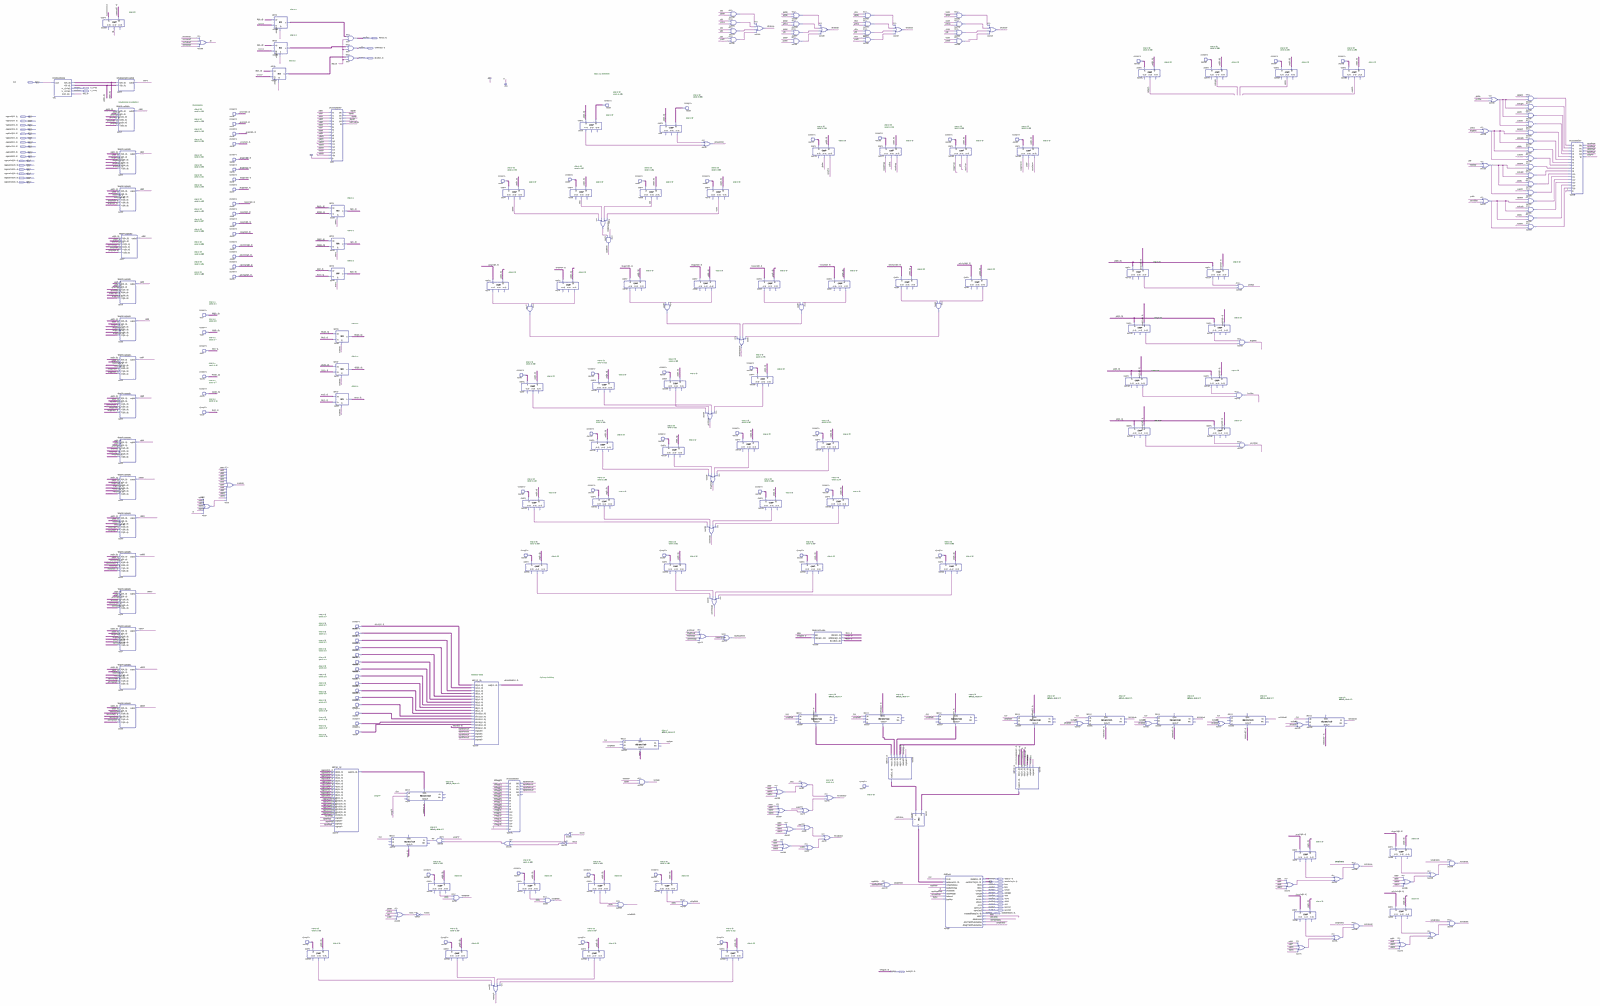
[diagram p0: schematic sheet, whole]
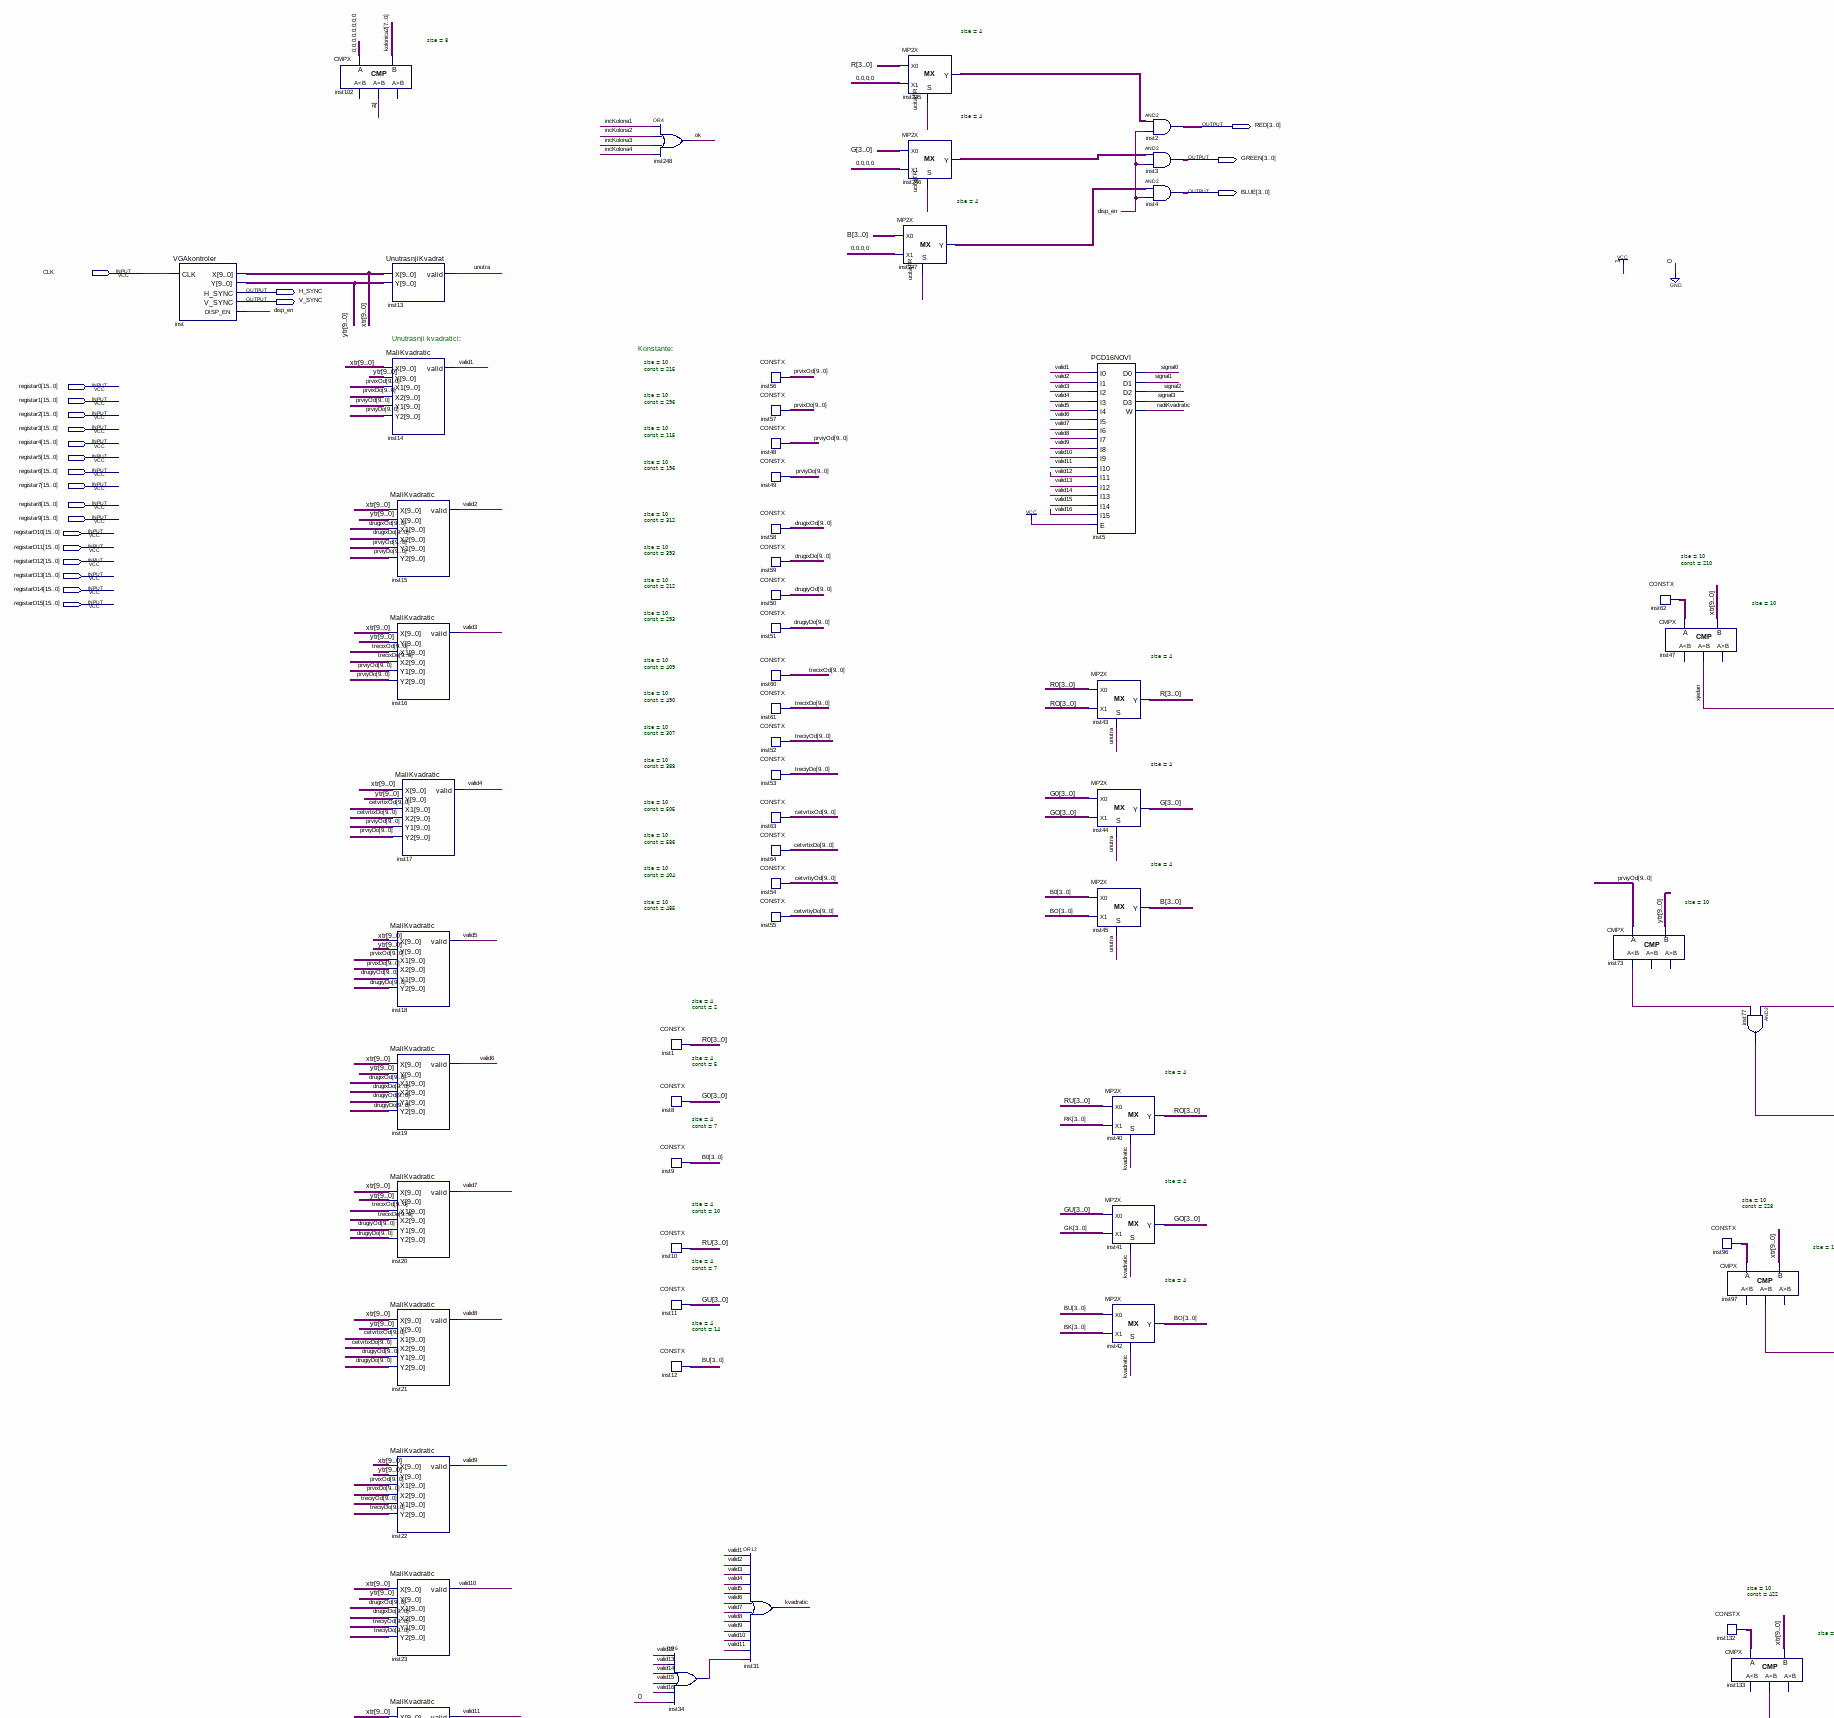
[diagram p1: schematic sheet, upper left part]
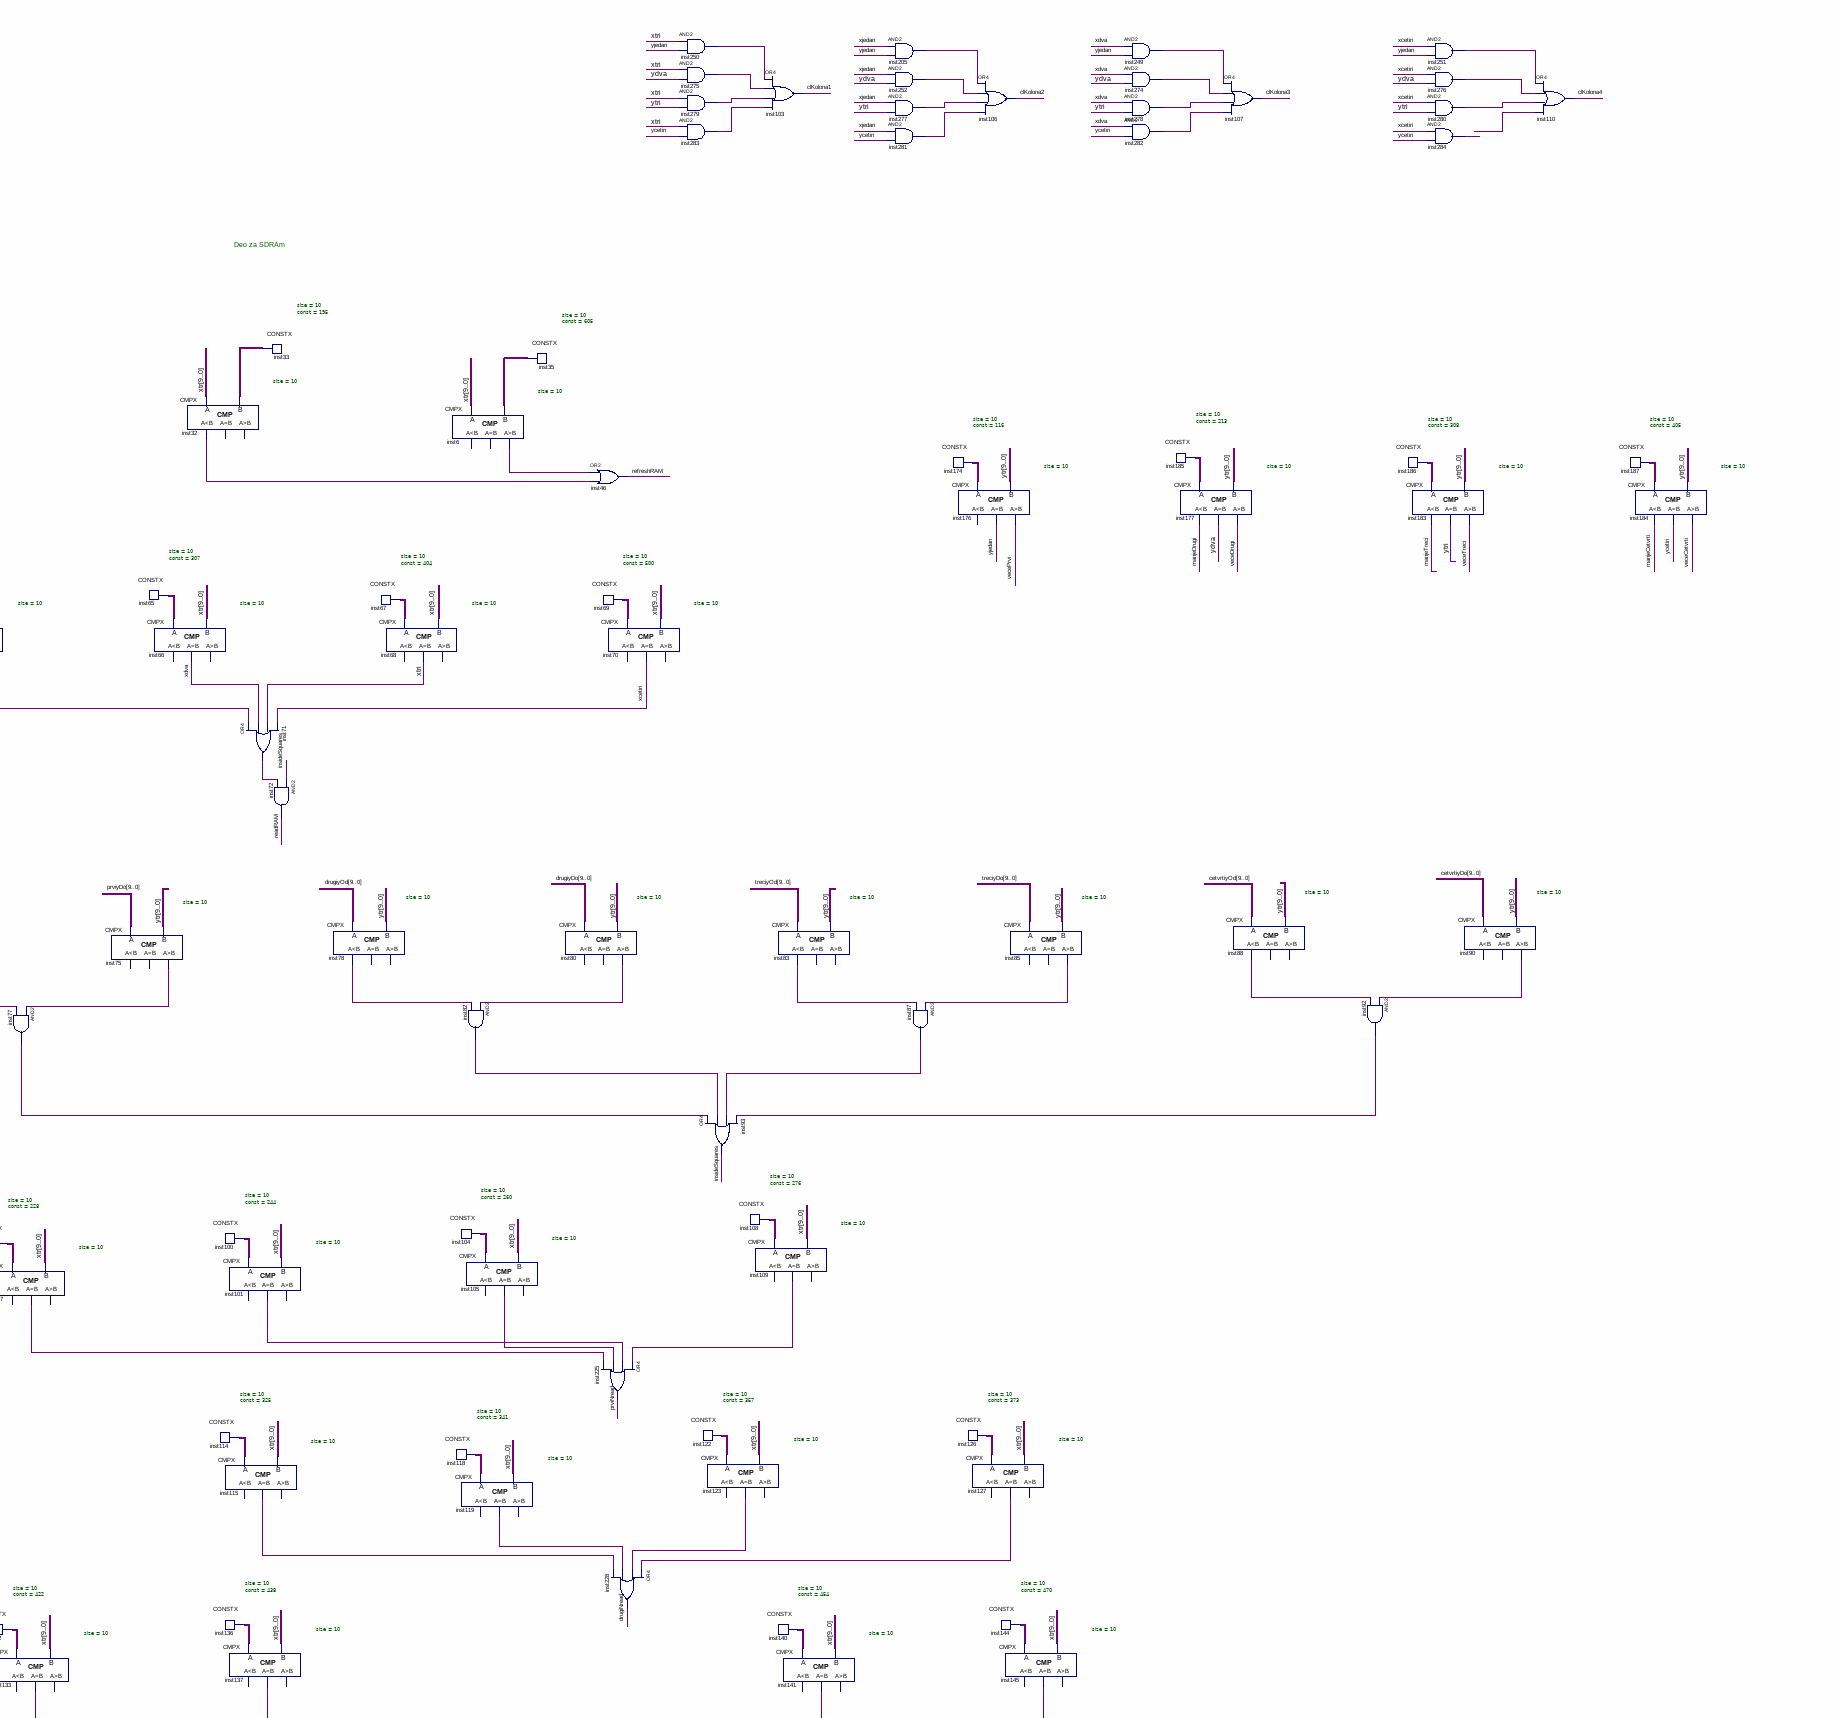
[diagram p2: schematic sheet, upper centre part]
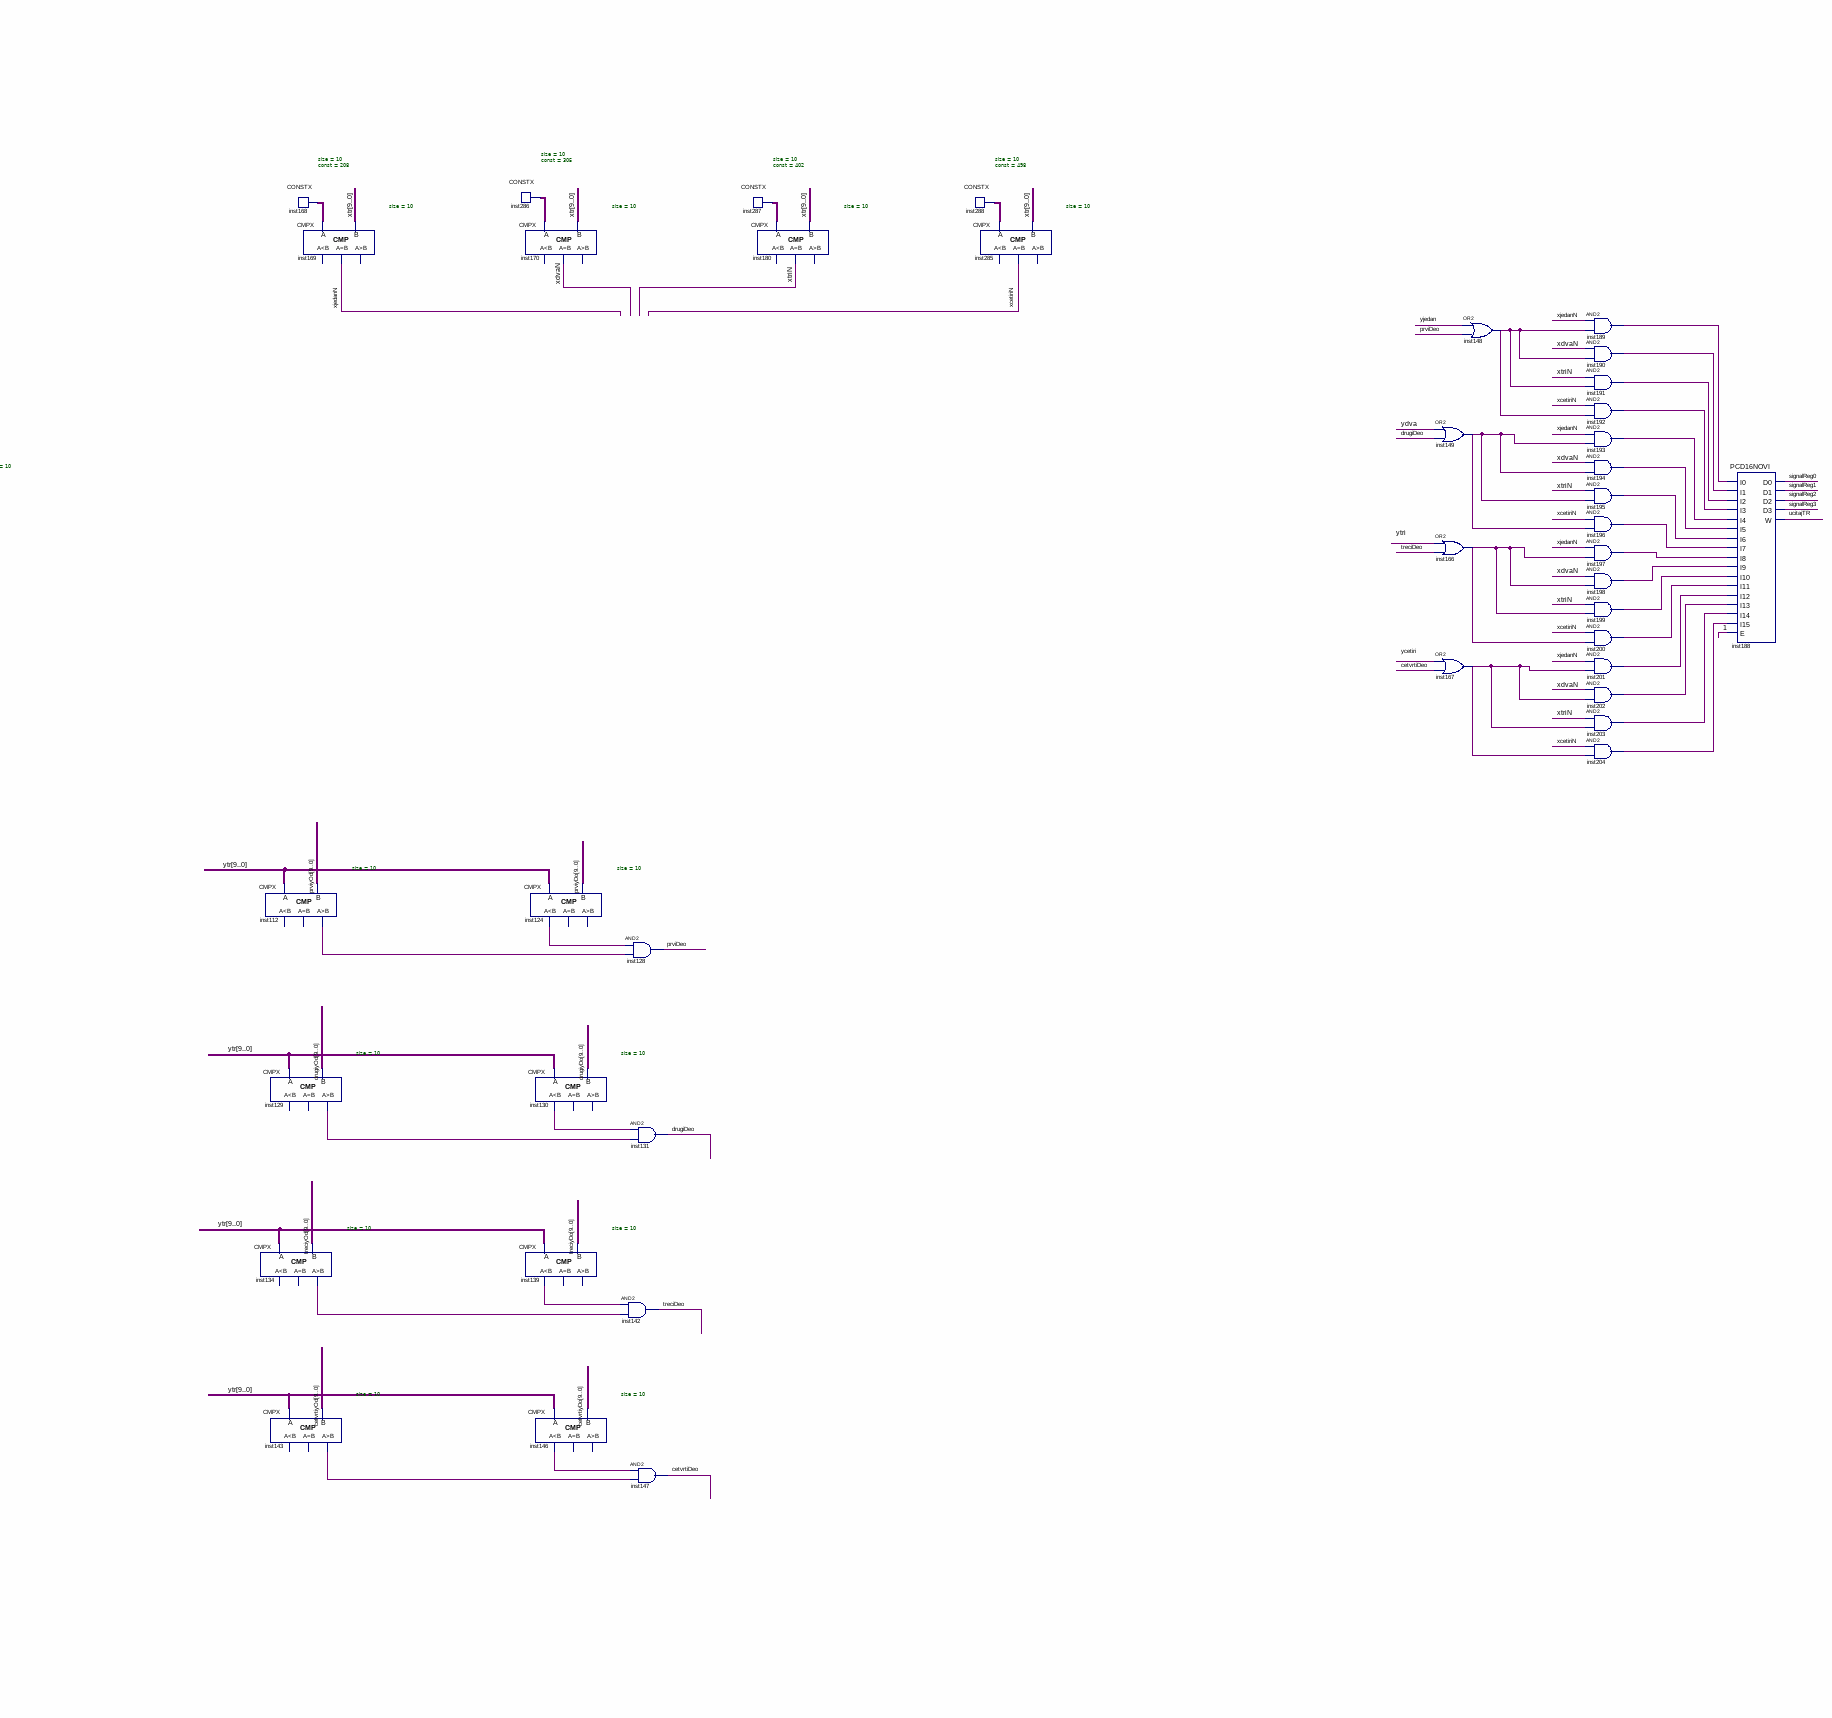
[diagram p3: schematic sheet, upper right part]
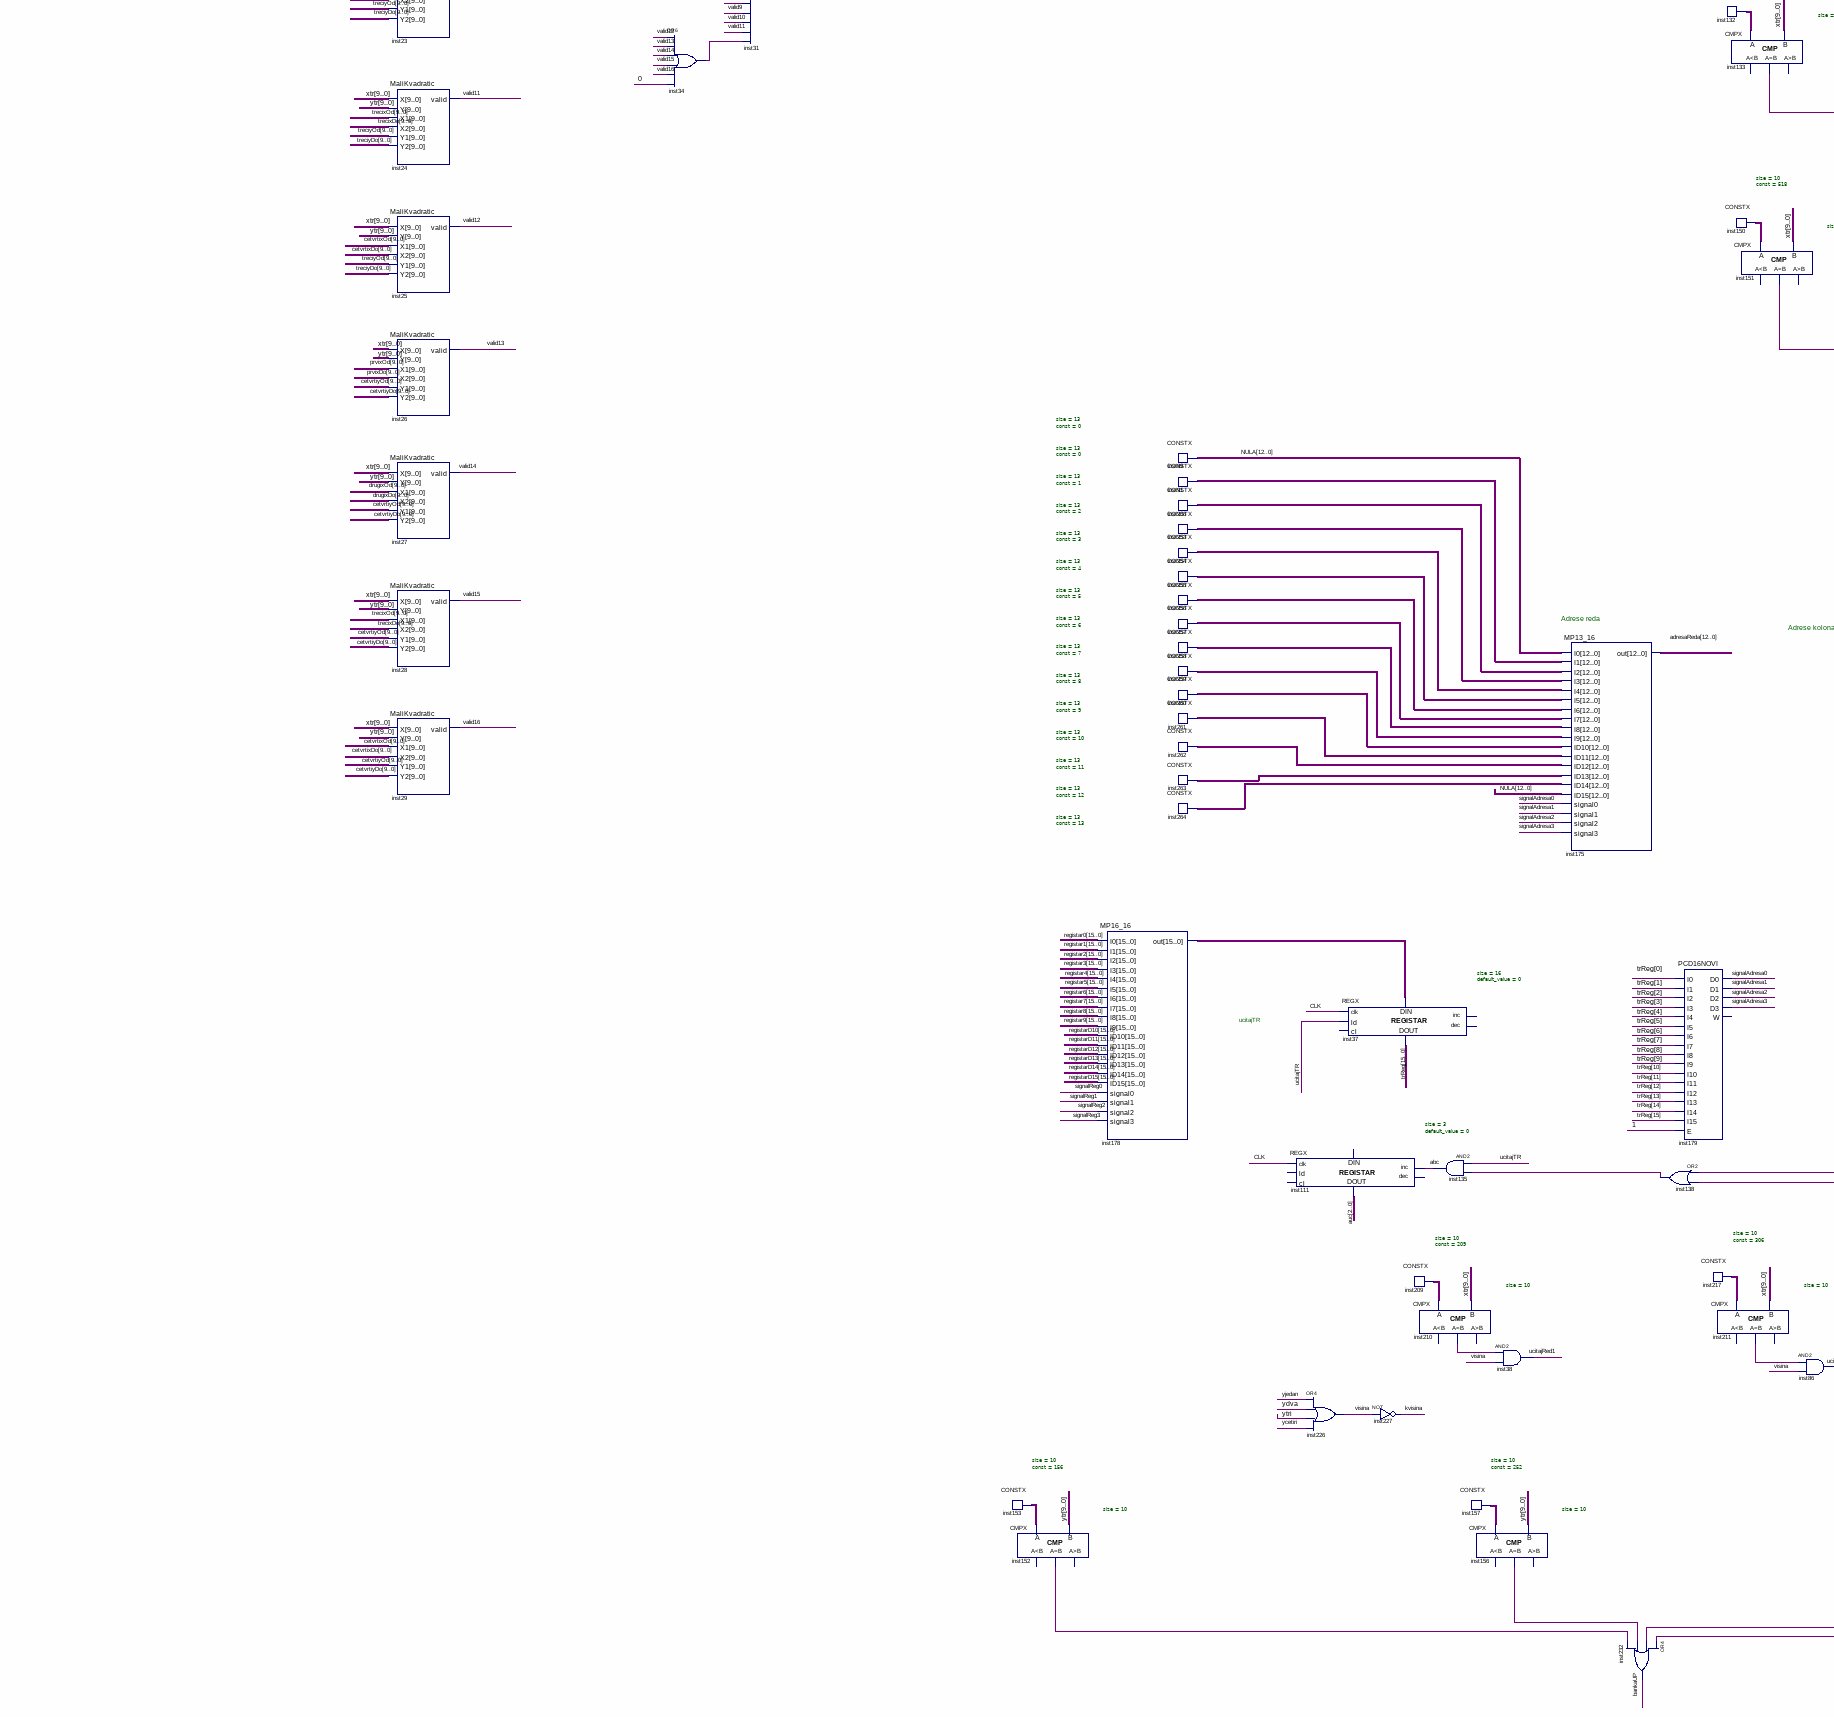
[diagram p4: schematic sheet, lower left part]
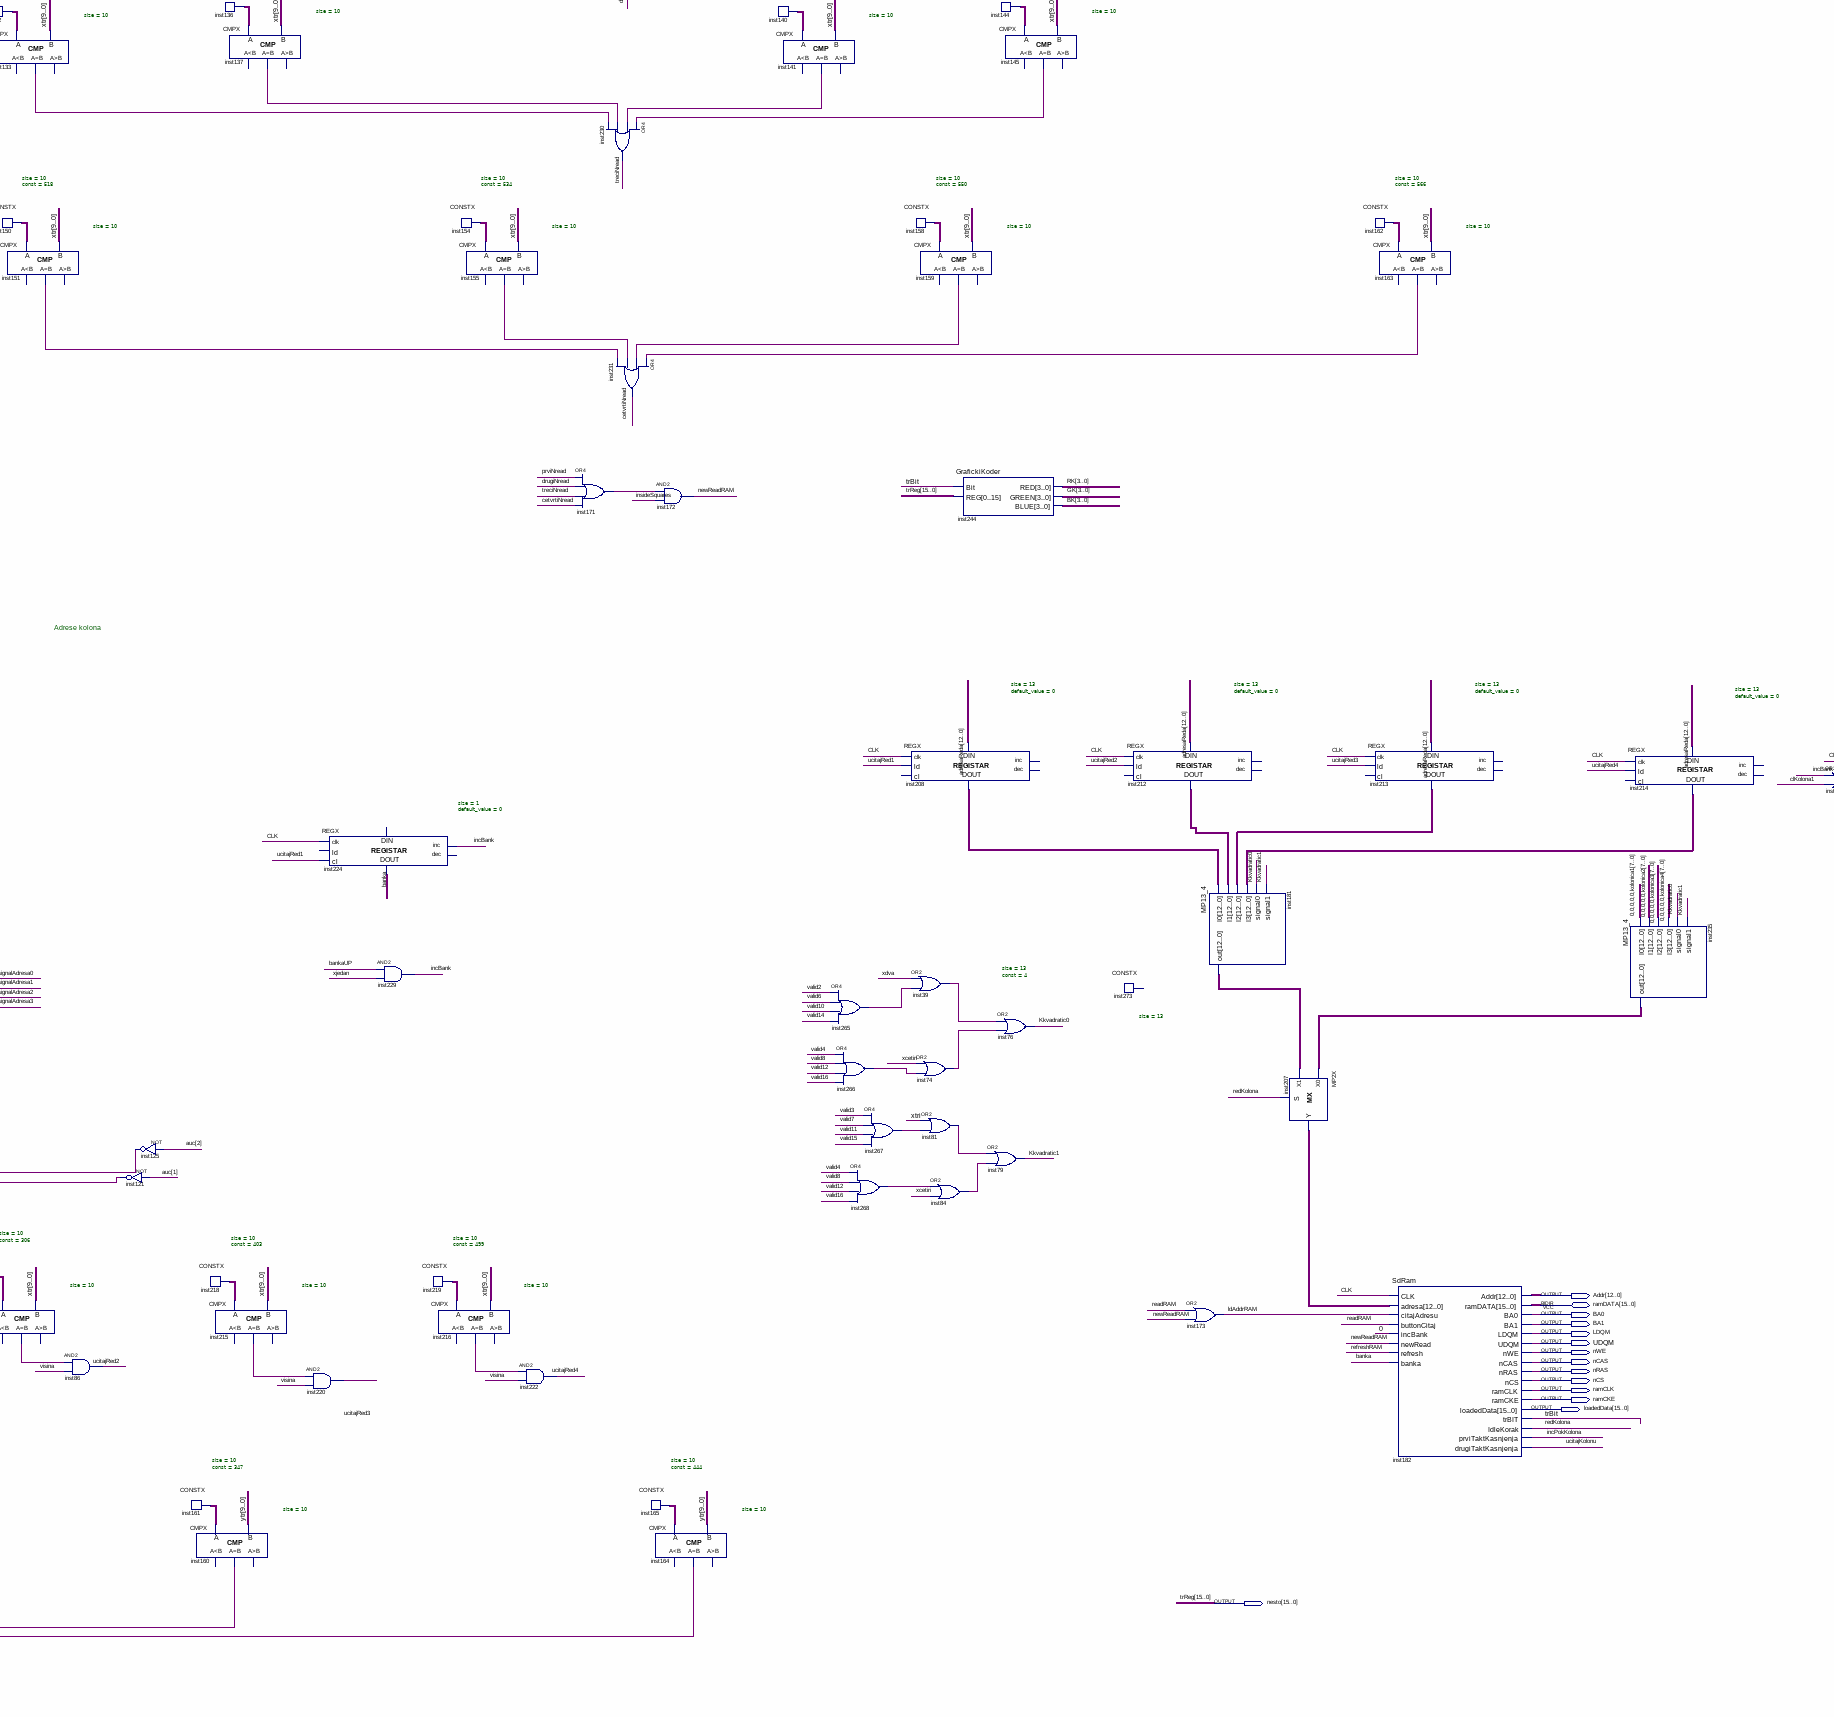
[diagram p5: schematic sheet, lower centre part]
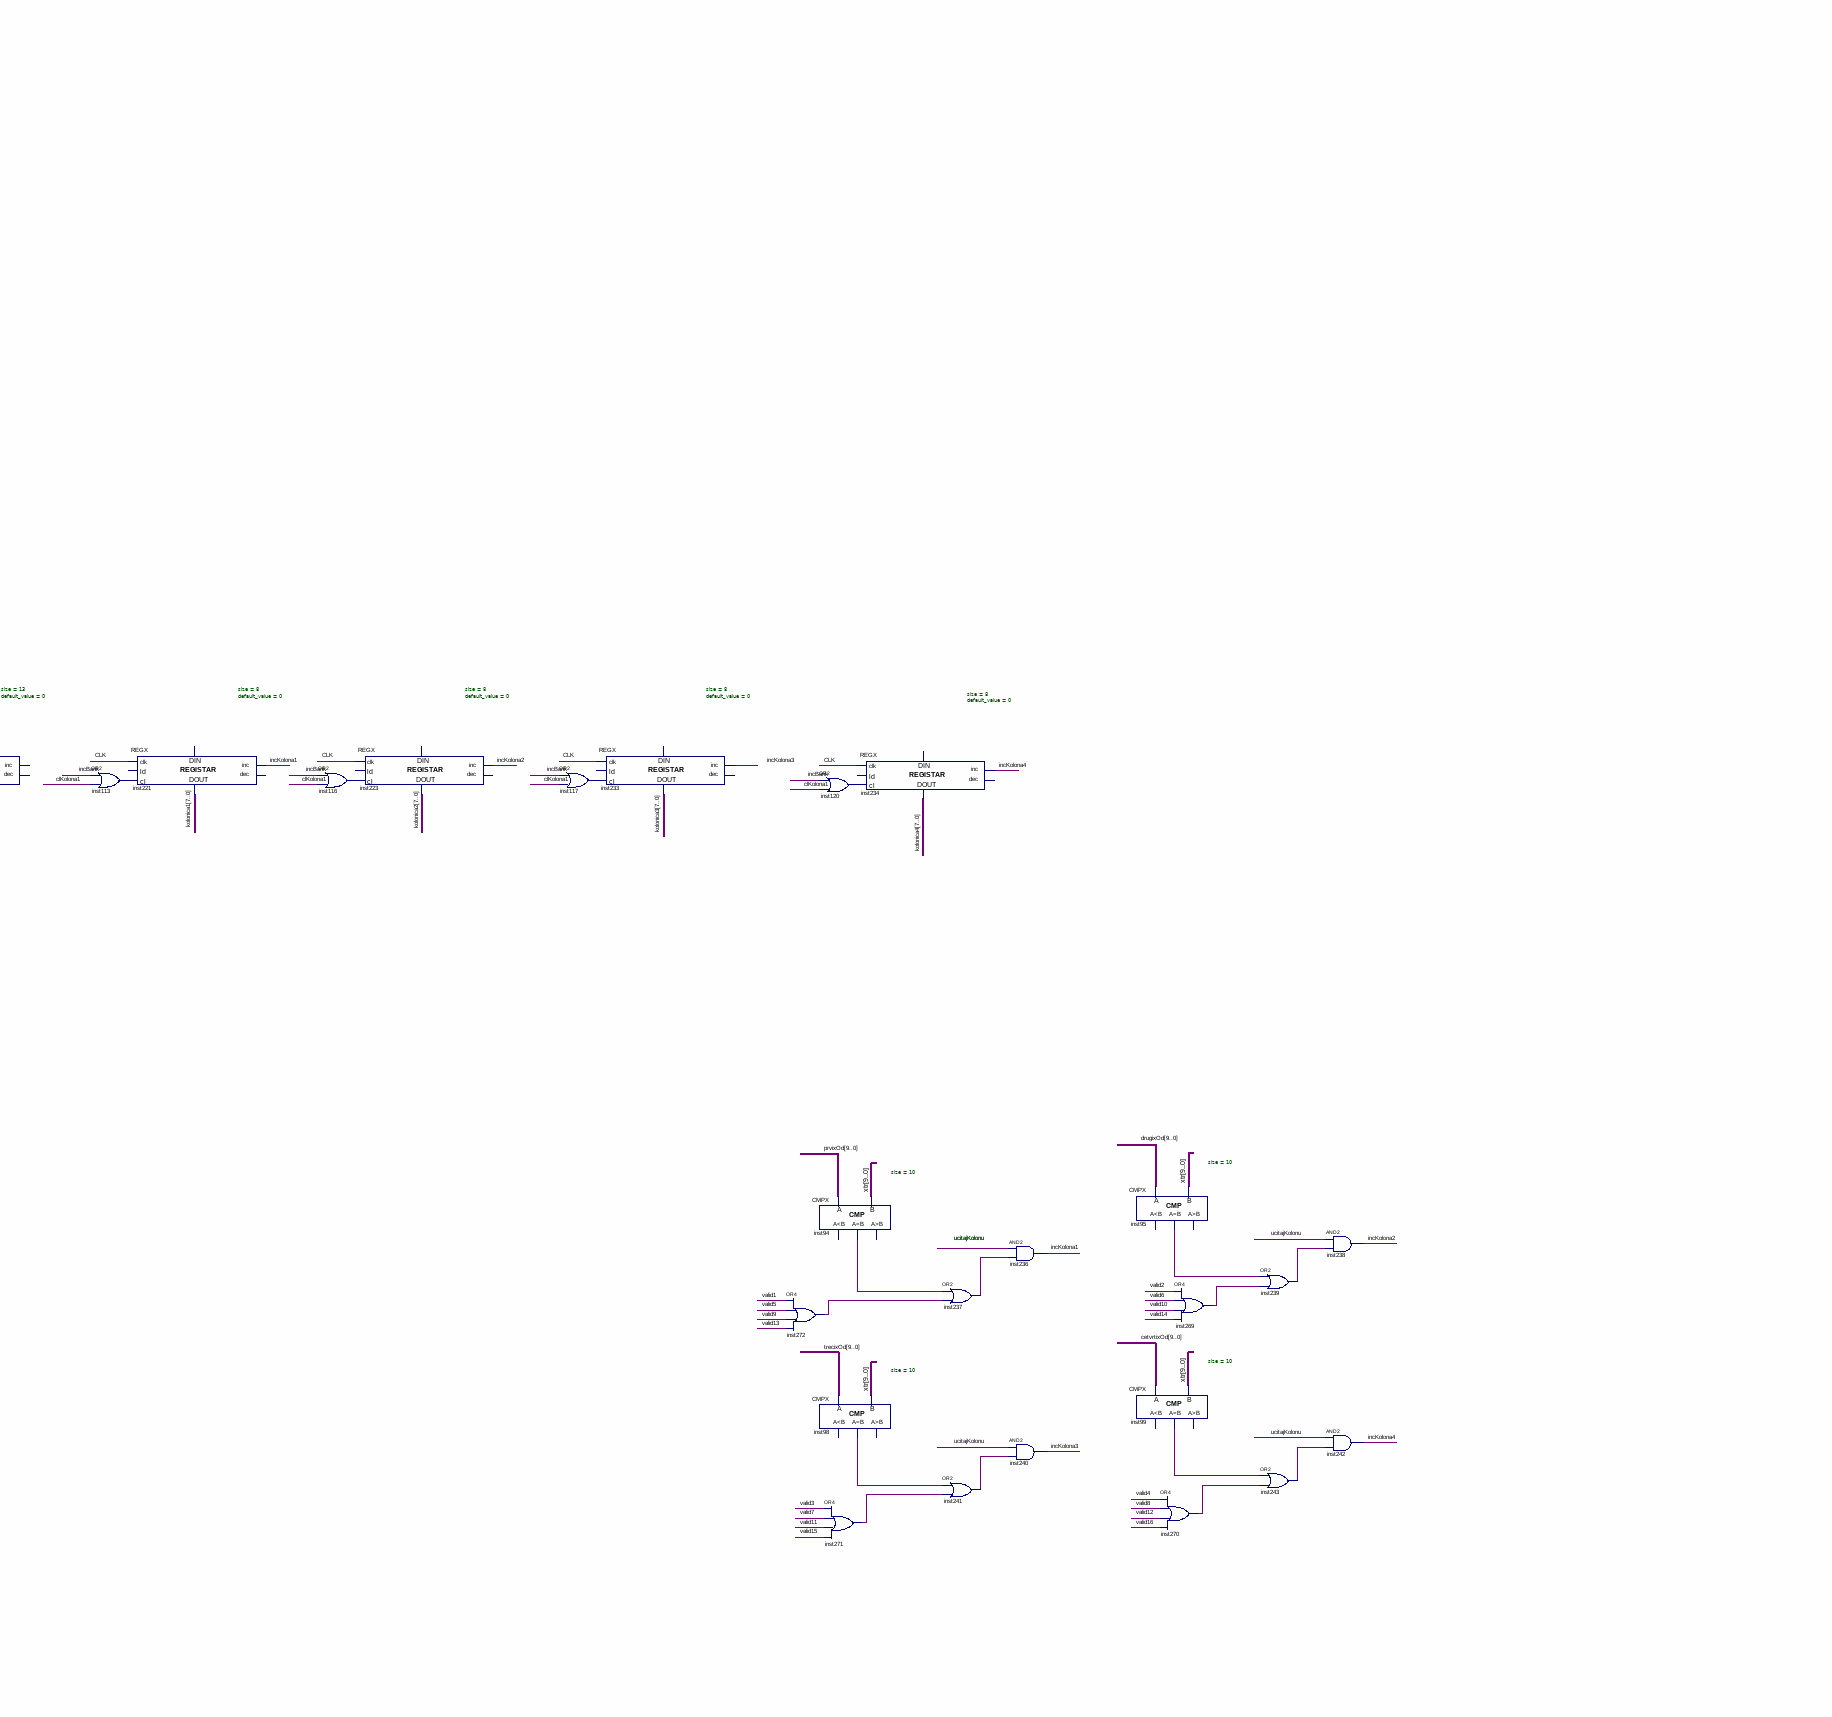
[diagram p6: schematic sheet, lower right part]
// Quartus schematic Grafika.bdf as structural Verilog: 286 symbols, 36 pins
module Grafika (
  input  CLK,
  input  [15:0] registar0,
  input  [15:0] registar1,
  input  [15:0] registar2,
  input  [15:0] registar3,
  input  [15:0] registar4,
  input  [15:0] registar5,
  input  [15:0] registar6,
  input  [15:0] registar7,
  input  [15:0] registar8,
  input  [15:0] registar9,
  input  [15:0] registarD10,
  input  [15:0] registarD11,
  input  [15:0] registarD12,
  input  [15:0] registarD13,
  input  [15:0] registarD14,
  input  [15:0] registarD15,
  inout  [15:0] ramDATA,
  output [3:0] RED,
  output [3:0] GREEN,
  output [3:0] BLUE,
  output H_SYNC,
  output V_SYNC,
  output [12:0] Addr,
  output BA0,
  output BA1,
  output LDQM,
  output UDQM,
  output nWE,
  output nCAS,
  output nRAS,
  output nCS,
  output ramCLK,
  output ramCKE,
  output [15:0] loadedData,
  output [15:0] nesto
);

  wire abc, aj, banka, bankaUP, cetvrtiDeo, cetvrtiNread, clKolona1, clKolona2, clKolona3, clKolona4,
       disp_en, drugiDeo, drugiNread, incBank, incKolona1, incKolona2, incKolona3, incKolona4, incPokKolona,
       insideSquares, inst6_gr, inst32_ls, inst34_out, inst39_out, inst71_out, inst73_ls, inst74_out,
       inst75_gr, inst77_out, inst78_ls, inst80_gr, inst81_out, inst82_out, inst83_ls, inst84_out, inst85_gr,
       inst87_out, inst88_ls, inst90_gr, inst92_out, inst94_eq, inst95_eq, inst97_eq, inst98_eq, inst99_eq,
       inst101_eq, inst105_eq, inst109_eq, inst112_gr, inst113_out, inst115_eq, inst116_out, inst117_out,
       inst119_eq, inst120_out, inst121_out, inst123_eq, inst124_ls, inst125_out, inst127_eq, inst129_gr,
       inst130_ls, inst133_eq, inst134_gr, inst137_eq, inst138_out, inst139_ls, inst141_eq, inst143_gr,
       inst145_eq, inst146_ls, inst148_out, inst149_out, inst151_eq, inst152_eq, inst155_eq, inst156_eq,
       inst159_eq, inst160_eq, inst163_eq, inst164_eq, inst166_out, inst167_out, inst171_out, inst189_out,
       inst190_out, inst191_out, inst192_out, inst193_out, inst194_out, inst195_out, inst196_out,
       inst197_out, inst198_out, inst199_out, inst200_out, inst201_out, inst202_out, inst203_out,
       inst204_out, inst205_out, inst210_eq, inst211_eq, inst215_eq, inst216_eq, inst237_out, inst239_out,
       inst241_out, inst243_out, inst249_out, inst250_out, inst251_out, inst252_out, inst265_out,
       inst266_out, inst267_out, inst268_out, inst269_out, inst270_out, inst271_out, inst272_out,
       inst274_out, inst275_out, inst276_out, inst277_out, inst278_out, inst279_out, inst280_out,
       inst281_out, inst282_out, inst283_out, inst284_out, Kkvadratic0, Kkvadratic1, kvadratic, kvisina,
       ldAddrRAM, manjeCetvrti, manjeDrugi, manjeTreci, newReadRAM, ok, prviDeo, prviNread, radiKvadratic,
       readRAM, redKolona, refreshRAM, signal0, signal1, signal2, signal3, signalAdresa0, signalAdresa1,
       signalAdresa2, signalAdresa3, signalReg0, signalReg1, signalReg2, signalReg3, trBit, treciDeo,
       treciNread, ucitajKolonu, ucitajRed1, ucitajRed2, ucitajRed3, ucitajRed4, ucitajTR, undriven, unutra,
       valid1, valid2, valid3, valid4, valid5, valid6, valid7, valid8, valid9, valid10, valid11, valid12,
       valid13, valid14, valid15, valid16, veceCetvrti, veceDrugi, vecePrvi, veceTreci, visina, xcetiri,
       xcetiriN, xdva, xdvaN, xjedan, xjedanN, xtri, xtriN, ycetiri, ydva, yjedan, ytri;
  wire [2:0] auc;
  wire [3:0] B, B0, BK, BO, BU, G, G0, GK, GO, GU, inst245_y, inst246_y, inst247_y, R, R0, RK, RO, RU;
  wire [7:0] kolonica1, kolonica2, kolonica3, kolonica4;
  wire [9:0] cetvrtixDo, cetvrtixOd, cetvrtiyDo, cetvrtiyOd, drugixDo, drugixOd, drugiyDo, drugiyOd,
       inst33_data, inst35_data, inst62_data, inst65_data, inst67_data, inst69_data, inst96_data,
       inst100_data, inst104_data, inst108_data, inst114_data, inst118_data, inst122_data, inst126_data,
       inst132_data, inst136_data, inst140_data, inst144_data, inst150_data, inst153_data, inst154_data,
       inst157_data, inst158_data, inst161_data, inst162_data, inst165_data, inst168_data, inst174_data,
       inst185_data, inst186_data, inst187_data, inst209_data, inst217_data, inst218_data, inst219_data,
       inst286_data, inst287_data, inst288_data, prvixDo, prvixOd, prviyDo, prviyOd, trecixDo, trecixOd,
       treciyDo, treciyOd, xtr, ytr;
  wire [12:0] adresaReda, inst91_data, inst181_out, inst206_data, inst207_y, inst208_data_out,
       inst212_data_out, inst213_data_out, inst214_data_out, inst235_out, inst253_data, inst254_data,
       inst255_data, inst256_data, inst257_data, inst258_data, inst259_data, inst260_data, inst261_data,
       inst262_data, inst263_data, inst264_data, NULA;
  wire [15:0] inst178_out;

  VGAkontroler inst (.CLK(CLK), .X(xtr), .Y(ytr), .H_SYNC(H_SYNC), .V_SYNC(V_SYNC), .DISP_EN(disp_en));
  CMPX #(.size(8)) inst102 (.A({8{1'b0}}), .B(kolonica2), .eq(aj));  // open: ls, gr
  UnutrasnjiKvadrat inst13 (.X(xtr), .Y(ytr), .valid(unutra));
  MaliKvadratic inst14 (.X(xtr), .Y(ytr), .X1(prvixOd), .X2(prvixDo), .Y1(prviyOd), .Y2(prviyDo), .valid(valid1));
  MaliKvadratic inst15 (.X(xtr), .Y(ytr), .X1(drugixOd), .X2(drugixDo), .Y1(prviyOd), .Y2(prviyDo), .valid(valid2));
  MaliKvadratic inst16 (.X(xtr), .Y(ytr), .X1(trecixOd), .X2(trecixDo), .Y1(prviyOd), .Y2(prviyDo), .valid(valid3));
  MaliKvadratic inst17 (.X(xtr), .Y(ytr), .X1(cetvrtixOd), .X2(cetvrtixDo), .Y1(prviyOd), .Y2(prviyDo), .valid(valid4));
  MaliKvadratic inst18 (.X(xtr), .Y(ytr), .X1(prvixOd), .X2(prvixDo), .Y1(drugiyOd), .Y2(drugiyDo), .valid(valid5));
  MaliKvadratic inst19 (.X(xtr), .Y(ytr), .X1(drugixOd), .X2(drugixDo), .Y1(drugiyOd), .Y2(drugiyDo), .valid(valid6));
  MaliKvadratic inst20 (.X(xtr), .Y(ytr), .X1(trecixOd), .X2(trecixDo), .Y1(drugiyOd), .Y2(drugiyDo), .valid(valid7));
  MaliKvadratic inst21 (
    .X(xtr), .Y(ytr), .X1(cetvrtixOd), .X2(cetvrtixDo), .Y1(drugiyOd), .Y2(drugiyDo), .valid(valid8));
  MaliKvadratic inst22 (.X(xtr), .Y(ytr), .X1(prvixOd), .X2(prvixDo), .Y1(treciyOd), .Y2(treciyDo), .valid(valid9));
  MaliKvadratic inst23 (.X(xtr), .Y(ytr), .X1(drugixOd), .X2(drugixDo), .Y1(treciyOd), .Y2(treciyDo), .valid(valid10));
  MaliKvadratic inst24 (.X(xtr), .Y(ytr), .X1(trecixOd), .X2(trecixDo), .Y1(treciyOd), .Y2(treciyDo), .valid(valid11));
  MaliKvadratic inst25 (
    .X(xtr), .Y(ytr), .X1(cetvrtixOd), .X2(cetvrtixDo), .Y1(treciyOd), .Y2(treciyDo), .valid(valid12));
  MaliKvadratic inst26 (
    .X(xtr), .Y(ytr), .X1(prvixOd), .X2(prvixDo), .Y1(cetvrtiyOd), .Y2(cetvrtiyDo), .valid(valid13));
  MaliKvadratic inst27 (
    .X(xtr), .Y(ytr), .X1(drugixOd), .X2(drugixDo), .Y1(cetvrtiyOd), .Y2(cetvrtiyDo), .valid(valid14));
  MaliKvadratic inst28 (
    .X(xtr), .Y(ytr), .X1(trecixOd), .X2(trecixDo), .Y1(cetvrtiyOd), .Y2(cetvrtiyDo), .valid(valid15));
  MaliKvadratic inst29 (
    .X(xtr), .Y(ytr), .X1(cetvrtixOd), .X2(cetvrtixDo), .Y1(cetvrtiyOd), .Y2(cetvrtiyDo), .valid(valid16));
  or inst248 (ok, incKolona1, incKolona2, incKolona3, incKolona4);
  CONSTX #(.size(4), .\const (2)) inst1 (.data(R0));
  CONSTX #(.size(4), .\const (5)) inst8 (.data(G0));
  CONSTX #(.size(4), .\const (7)) inst9 (.data(B0));
  CONSTX #(.size(4), .\const (10)) inst10 (.data(RU));
  CONSTX #(.size(4), .\const (7)) inst11 (.data(GU));
  CONSTX #(.size(4), .\const (14)) inst12 (.data(BU));
  or inst34 (inst34_out, valid12, valid13, valid14, valid15, valid16, 1'b0);
  CONSTX #(.size(10), .\const (215)) inst56 (.data(prvixOd));
  CONSTX #(.size(10), .\const (296)) inst57 (.data(prvixDo));
  CONSTX #(.size(10), .\const (115)) inst48 (.data(prviyOd));
  CONSTX #(.size(10), .\const (196)) inst49 (.data(prviyDo));
  CONSTX #(.size(10), .\const (312)) inst58 (.data(drugixOd));
  CONSTX #(.size(10), .\const (393)) inst59 (.data(drugixDo));
  CONSTX #(.size(10), .\const (212)) inst50 (.data(drugiyOd));
  CONSTX #(.size(10), .\const (293)) inst51 (.data(drugiyDo));
  CONSTX #(.size(10), .\const (409)) inst60 (.data(trecixOd));
  CONSTX #(.size(10), .\const (490)) inst61 (.data(trecixDo));
  CONSTX #(.size(10), .\const (307)) inst52 (.data(treciyOd));
  CONSTX #(.size(10), .\const (388)) inst53 (.data(treciyDo));
  CONSTX #(.size(10), .\const (505)) inst63 (.data(cetvrtixOd));
  CONSTX #(.size(10), .\const (586)) inst64 (.data(cetvrtixDo));
  CONSTX #(.size(10), .\const (404)) inst54 (.data(cetvrtiyOd));
  CONSTX #(.size(10), .\const (485)) inst55 (.data(cetvrtiyDo));
  or inst31 (kvadratic, valid1, valid2, valid3, valid4, valid5, valid6, valid7, valid8, valid9, valid10, valid11, inst34_out);
  MP2X #(.size(4)) inst245 (.S(ucitajTR), .X0(R), .X1(4'b0000), .Y(inst245_y));
  MP2X #(.size(4)) inst246 (.S(ucitajTR), .X0(G), .X1(4'b0000), .Y(inst246_y));
  MP2X #(.size(4)) inst247 (.S(ucitajTR), .X0(B), .X1(4'b0000), .Y(inst247_y));
  CONSTX #(.size(10), .\const (156)) inst153 (.data(inst153_data));
  CMPX #(.size(10)) inst152 (.A(inst153_data), .B(ytr), .eq(inst152_eq));  // open: ls, gr
  PCD16NOVI inst5 (
    .I0(valid1), .I1(valid2), .I2(valid3), .I3(valid4), .I4(valid5), .I5(valid6), .I6(valid7), .I7(valid8),
    .I8(valid9), .I9(valid10), .I10(valid11), .I11(valid12), .I12(valid13), .I13(valid14), .I14(valid15),
    .I15(valid16), .E(1'b1), .D0(signal0), .D1(signal1), .D2(signal2), .D3(signal3), .W(radiKvadratic));
  MP2X #(.size(4)) inst43 (.S(unutra), .X0(R0), .X1(RO), .Y(R));
  MP2X #(.size(4)) inst44 (.S(unutra), .X0(G0), .X1(GO), .Y(G));
  MP2X #(.size(4)) inst45 (.S(unutra), .X0(B0), .X1(BO), .Y(B));
  MP16_16 inst178 (
    .I0(registar0), .I1(registar1), .I2(registar2), .I3(registar3), .I4(registar4), .I5(registar5),
    .I6(registar6), .I7(registar7), .I8(registar8), .I9(registar9), .ID10(registarD10), .ID11(registarD11),
    .ID12(registarD12), .ID13(registarD13), .ID14(registarD14), .ID15(registarD15), .signal0(signalReg0),
    .signal1(signalReg1), .signal2(signalReg2), .signal3(signalReg3), .out(inst178_out));
  MP2X #(.size(4)) inst40 (.S(kvadratic), .X0(RU), .X1(RK), .Y(RO));
  MP2X #(.size(4)) inst41 (.S(kvadratic), .X0(GU), .X1(GK), .Y(GO));
  MP2X #(.size(4)) inst42 (.S(kvadratic), .X0(BU), .X1(BK), .Y(BO));
  assign RED = inst245_y & {4{disp_en}};  // AND2 inst2, 4 bits wide
  assign GREEN = inst246_y & {4{disp_en}};  // AND2 inst3, 4 bits wide
  assign BLUE = inst247_y & {4{disp_en}};  // AND2 inst4, 4 bits wide
  CONSTX #(.size(13), .\const (0)) inst89 (.data(NULA));
  CONSTX #(.size(13), .\const (0)) inst91 (.data(inst91_data));
  CONSTX #(.size(13), .\const (1)) inst206 (.data(inst206_data));
  CONSTX #(.size(13), .\const (2)) inst253 (.data(inst253_data));
  CONSTX #(.size(13), .\const (3)) inst254 (.data(inst254_data));
  CONSTX #(.size(13), .\const (4)) inst255 (.data(inst255_data));
  CONSTX #(.size(13), .\const (5)) inst256 (.data(inst256_data));
  CONSTX #(.size(13), .\const (6)) inst257 (.data(inst257_data));
  CONSTX #(.size(13), .\const (7)) inst258 (.data(inst258_data));
  CONSTX #(.size(13), .\const (8)) inst259 (.data(inst259_data));
  CONSTX #(.size(13), .\const (9)) inst260 (.data(inst260_data));
  CONSTX #(.size(13), .\const (10)) inst261 (.data(inst261_data));
  CONSTX #(.size(13), .\const (11)) inst262 (.data(inst262_data));
  CONSTX #(.size(13), .\const (12)) inst263 (.data(inst263_data));
  CONSTX #(.size(13), .\const (13)) inst264 (.data(inst264_data));
  REGX #(.size(3), .default_value(0)) inst111 (.clk(CLK), .inc(abc), .data_out(auc));  // open: ld, cl, dec, data_in
  or inst226 (visina, yjedan, ydva, ytri, ycetiri);
  REGX #(.size(16), .default_value(0)) inst37 (
    .clk(CLK), .ld(ucitajTR), .data_in(inst178_out), .data_out(nesto));  // open: cl, inc, dec
  CONSTX #(.size(10), .\const (209)) inst209 (.data(inst209_data));
  not inst227 (kvisina, visina);
  and inst135 (abc, ucitajTR, inst138_out);
  CMPX #(.size(10)) inst210 (.A(inst209_data), .B(xtr), .eq(inst210_eq));  // open: ls, gr
  CONSTX #(.size(10), .\const (252)) inst157 (.data(inst157_data));
  CMPX #(.size(10)) inst156 (.A(inst157_data), .B(ytr), .eq(inst156_eq));  // open: ls, gr
  and inst38 (ucitajRed1, inst210_eq, visina);
  MP13_16 inst175 (
    .I0(NULA), .I1(inst91_data), .I2(inst206_data), .I3(inst253_data), .I4(inst254_data), .I5(inst255_data),
    .I6(inst256_data), .I7(inst257_data), .I8(inst258_data), .I9(inst259_data), .ID10(inst260_data),
    .ID11(inst261_data), .ID12(inst262_data), .ID13(inst263_data), .ID14(inst264_data), .ID15(NULA),
    .signal0(signalAdresa0), .signal1(signalAdresa1), .signal2(signalAdresa2), .signal3(signalAdresa3),
    .out(adresaReda));
  CMPX #(.size(10)) inst73 (.A(prviyOd), .B(ytr), .ls(inst73_ls));  // open: eq, gr
  or inst232 (bankaUP, inst164_eq, inst160_eq, inst156_eq, inst152_eq);
  CONSTX #(.size(10), .\const (210)) inst62 (.data(inst62_data));
  CMPX #(.size(10)) inst47 (.A(inst62_data), .B(xtr), .eq(xjedan));  // open: ls, gr
  or inst138 (inst138_out, inst125_out, inst121_out);
  PCD16NOVI inst179 (
    .I0(nesto[0]), .I1(nesto[1]), .I2(nesto[2]), .I3(nesto[3]), .I4(nesto[4]), .I5(nesto[5]), .I6(nesto[6]),
    .I7(nesto[7]), .I8(nesto[8]), .I9(nesto[9]), .I10(nesto[10]), .I11(nesto[11]), .I12(nesto[12]),
    .I13(nesto[13]), .I14(nesto[14]), .I15(nesto[15]), .E(1'b1), .D0(signalAdresa0), .D1(signalAdresa1),
    .D2(signalAdresa2), .D3(signalAdresa3));  // open: W
  CONSTX #(.size(10), .\const (306)) inst217 (.data(inst217_data));
  and inst77 (inst77_out, inst75_gr, inst73_ls);
  CONSTX #(.size(10), .\const (228)) inst96 (.data(inst96_data));
  CMPX #(.size(10)) inst97 (.A(inst96_data), .B(xtr), .eq(inst97_eq));  // open: ls, gr
  CONSTX #(.size(10), .\const (422)) inst132 (.data(inst132_data));
  CMPX #(.size(10)) inst133 (.A(inst132_data), .B(xtr), .eq(inst133_eq));  // open: ls, gr
  CONSTX #(.size(10), .\const (518)) inst150 (.data(inst150_data));
  CMPX #(.size(10)) inst151 (.A(inst150_data), .B(xtr), .eq(inst151_eq));  // open: ls, gr
  CMPX #(.size(10)) inst211 (.A(inst217_data), .B(xtr), .eq(inst211_eq));  // open: ls, gr
  and inst86 (ucitajRed2, inst211_eq, visina);
  CMPX #(.size(10)) inst75 (.A(prviyDo), .B(ytr), .gr(inst75_gr));  // open: ls, eq
  not inst121 (inst121_out, auc[1]);
  CONSTX #(.size(10), .\const (307)) inst65 (.data(inst65_data));
  CMPX #(.size(10)) inst66 (.A(inst65_data), .B(xtr), .eq(xdva));  // open: ls, gr
  not inst125 (inst125_out, auc[2]);
  CMPX #(.size(10)) inst32 (.A(xtr), .B(inst33_data), .ls(inst32_ls));  // open: eq, gr
  CONSTX #(.size(10), .\const (403)) inst218 (.data(inst218_data));
  CONSTX #(.size(10), .\const (347)) inst161 (.data(inst161_data));
  CMPX #(.size(10)) inst160 (.A(inst161_data), .B(ytr), .eq(inst160_eq));  // open: ls, gr
  CONSTX #(.size(10), .\const (244)) inst100 (.data(inst100_data));
  CMPX #(.size(10)) inst101 (.A(inst100_data), .B(xtr), .eq(inst101_eq));  // open: ls, gr
  CONSTX #(.size(10), .\const (325)) inst114 (.data(inst114_data));
  CMPX #(.size(10)) inst115 (.A(inst114_data), .B(xtr), .eq(inst115_eq));  // open: ls, gr
  CONSTX #(.size(10), .\const (438)) inst136 (.data(inst136_data));
  CMPX #(.size(10)) inst137 (.A(inst136_data), .B(xtr), .eq(inst137_eq));  // open: ls, gr
  CMPX #(.size(10)) inst215 (.A(inst218_data), .B(xtr), .eq(inst215_eq));  // open: ls, gr
  CONSTX #(.size(10), .\const (195)) inst33 (.data(inst33_data));
  or inst71 (inst71_out, xjedan, xdva, xtri, xcetiri);
  and inst72 (readRAM, insideSquares, inst71_out);
  and inst220 (ucitajRed3, inst215_eq, visina);
  CMPX #(.size(10)) inst78 (.A(drugiyOd), .B(ytr), .ls(inst78_ls));  // open: eq, gr
  REGX #(.size(1), .default_value(0)) inst224 (
    .clk(CLK), .cl(ucitajRed1), .inc(incBank), .data_out(banka));  // open: ld, dec, data_in
  CONSTX #(.size(10), .\const (404)) inst67 (.data(inst67_data));
  CMPX #(.size(10)) inst68 (.A(inst67_data), .B(xtr), .eq(xtri));  // open: ls, gr
  and inst229 (incBank, bankaUP, xjedan);
  CONSTX #(.size(10), .\const (499)) inst219 (.data(inst219_data));
  CMPX #(.size(10)) inst6 (.A(xtr), .B(inst35_data), .gr(inst6_gr));  // open: ls, eq
  and inst82 (inst82_out, inst80_gr, inst78_ls);
  CONSTX #(.size(10), .\const (260)) inst104 (.data(inst104_data));
  CMPX #(.size(10)) inst105 (.A(inst104_data), .B(xtr), .eq(inst105_eq));  // open: ls, gr
  CONSTX #(.size(10), .\const (341)) inst118 (.data(inst118_data));
  CMPX #(.size(10)) inst119 (.A(inst118_data), .B(xtr), .eq(inst119_eq));  // open: ls, gr
  CONSTX #(.size(10), .\const (534)) inst154 (.data(inst154_data));
  CMPX #(.size(10)) inst155 (.A(inst154_data), .B(xtr), .eq(inst155_eq));  // open: ls, gr
  CMPX #(.size(10)) inst216 (.A(inst219_data), .B(xtr), .eq(inst216_eq));  // open: ls, gr
  CONSTX #(.size(10), .\const (605)) inst35 (.data(inst35_data));
  and inst222 (ucitajRed4, inst216_eq, visina);
  CMPX #(.size(10)) inst80 (.A(drugiyDo), .B(ytr), .gr(inst80_gr));  // open: ls, eq
  or inst171 (inst171_out, prviNread, drugiNread, treciNread, cetvrtiNread);
  or inst46 (refreshRAM, inst6_gr, inst32_ls);
  CONSTX #(.size(10), .\const (500)) inst69 (.data(inst69_data));
  CMPX #(.size(10)) inst70 (.A(inst69_data), .B(xtr), .eq(xcetiri));  // open: ls, gr
  or inst225 (prviNread, inst109_eq, inst101_eq, inst105_eq, inst97_eq);
  or inst228 (drugiNread, inst127_eq, inst123_eq, inst119_eq, inst115_eq);
  or inst230 (treciNread, inst145_eq, inst141_eq, inst137_eq, inst133_eq);
  or inst231 (cetvrtiNread, inst163_eq, inst159_eq, inst155_eq, inst151_eq);
  CONSTX #(.size(10), .\const (444)) inst165 (.data(inst165_data));
  CMPX #(.size(10)) inst164 (.A(inst165_data), .B(ytr), .eq(inst164_eq));  // open: ls, gr
  and inst250 (inst250_out, xtri, yjedan);
  and inst275 (inst275_out, xtri, ydva);
  and inst279 (inst279_out, xtri, ytri);
  and inst283 (inst283_out, xtri, ycetiri);
  CONSTX #(.size(10), .\const (357)) inst122 (.data(inst122_data));
  and inst172 (newReadRAM, inst171_out, insideSquares);
  or inst93 (insideSquares, inst77_out, inst82_out, inst87_out, inst92_out);
  CMPX #(.size(10)) inst123 (.A(inst122_data), .B(xtr), .eq(inst123_eq));  // open: ls, gr
  or inst103 (clKolona1, inst250_out, inst275_out, inst279_out, inst283_out);
  CONSTX #(.size(10), .\const (276)) inst108 (.data(inst108_data));
  CMPX #(.size(10)) inst109 (.A(inst108_data), .B(xtr), .eq(inst109_eq));  // open: ls, gr
  CONSTX #(.size(10), .\const (454)) inst140 (.data(inst140_data));
  CMPX #(.size(10)) inst83 (.A(treciyOd), .B(ytr), .ls(inst83_ls));  // open: eq, gr
  CMPX #(.size(10)) inst141 (.A(inst140_data), .B(xtr), .eq(inst141_eq));  // open: ls, gr
  or inst265 (inst265_out, valid2, valid6, valid10, valid14);
  or inst266 (inst266_out, valid4, valid8, valid12, valid16);
  or inst267 (inst267_out, valid3, valid7, valid11, valid15);
  or inst268 (inst268_out, valid4, valid8, valid12, valid16);
  and inst205 (inst205_out, xjedan, yjedan);
  and inst252 (inst252_out, xjedan, ydva);
  and inst277 (inst277_out, xjedan, ytri);
  and inst281 (inst281_out, xjedan, ycetiri);
  and inst87 (inst87_out, inst85_gr, inst83_ls);
  CONSTX #(.size(10), .\const (550)) inst158 (.data(inst158_data));
  CMPX #(.size(10)) inst159 (.A(inst158_data), .B(xtr), .eq(inst159_eq));  // open: ls, gr
  REGX #(.size(13), .default_value(0)) inst208 (
    .clk(CLK), .ld(ucitajRed1), .data_in(adresaReda), .data_out(inst208_data_out));  // open: cl, inc, dec
  or inst39 (inst39_out, xdva, inst265_out);
  or inst74 (inst74_out, xcetiri, inst266_out);
  CONSTX #(.size(10), .\const (116)) inst174 (.data(inst174_data));
  CMPX #(.size(10)) inst176 (.A(inst174_data), .B(ytr), .eq(yjedan), .gr(vecePrvi));  // open: ls
  CONSTX #(.size(10), .\const (373)) inst126 (.data(inst126_data));
  GrafickiKoder inst244 (.Bit(trBit), .REG(nesto), .RED(RK), .GREEN(GK), .BLUE(BK));
  or inst81 (inst81_out, xtri, inst267_out);
  or inst84 (inst84_out, inst268_out, xcetiri);
  or inst106 (clKolona2, inst205_out, inst252_out, inst277_out, inst281_out);
  CMPX #(.size(10)) inst127 (.A(inst126_data), .B(xtr), .eq(inst127_eq));  // open: ls, gr
  CONSTX #(.size(10), .\const (470)) inst144 (.data(inst144_data));
  or inst79 (Kkvadratic1, inst81_out, inst84_out);
  CMPX #(.size(10)) inst85 (.A(treciyDo), .B(ytr), .gr(inst85_gr));  // open: ls, eq
  CMPX #(.size(10)) inst145 (.A(inst144_data), .B(xtr), .eq(inst145_eq));  // open: ls, gr
  or inst76 (Kkvadratic0, inst39_out, inst74_out);
  and inst249 (inst249_out, xdva, yjedan);
  and inst274 (inst274_out, xdva, ydva);
  and inst278 (inst278_out, xdva, ytri);
  and inst282 (inst282_out, xdva, ycetiri);
  REGX #(.size(13), .default_value(0)) inst212 (
    .clk(CLK), .ld(ucitajRed2), .data_in(adresaReda), .data_out(inst212_data_out));  // open: cl, inc, dec
  CONSTX #(.size(13), .\const (4)) inst273 ();  // open: data
  CONSTX #(.size(10), .\const (213)) inst185 (.data(inst185_data));
  CMPX #(.size(10)) inst177 (.A(inst185_data), .B(ytr), .ls(manjeDrugi), .eq(ydva), .gr(veceDrugi));
  MP13_4 inst181 (
    .I0(inst208_data_out), .I1(inst212_data_out), .I2(inst213_data_out), .I3(inst214_data_out),
    .signal0(Kkvadratic0), .signal1(Kkvadratic1), .out(inst181_out));
  or inst173 (ldAddrRAM, readRAM, newReadRAM);
  or inst107 (clKolona3, inst249_out, inst274_out, inst278_out, inst282_out);
  CMPX #(.size(10)) inst88 (.A(cetvrtiyOd), .B(ytr), .ls(inst88_ls));  // open: eq, gr
  MP2X #(.size(13)) inst207 (.S(redKolona), .X0(inst235_out), .X1(inst181_out), .Y(inst207_y));
  and inst92 (inst92_out, inst90_gr, inst88_ls);
  CONSTX #(.size(10), .\const (566)) inst162 (.data(inst162_data));
  CMPX #(.size(10)) inst163 (.A(inst162_data), .B(xtr), .eq(inst163_eq));  // open: ls, gr
  REGX #(.size(13), .default_value(0)) inst213 (
    .clk(CLK), .ld(ucitajRed3), .data_in(adresaReda), .data_out(inst213_data_out));  // open: cl, inc, dec
  CONSTX #(.size(10), .\const (308)) inst186 (.data(inst186_data));
  CMPX #(.size(10)) inst183 (.A(inst186_data), .B(ytr), .ls(manjeTreci), .eq(ytri), .gr(veceTreci));
  SdRam inst182 (
    .CLK(CLK), .adresa(inst207_y), .citajAdresu(ldAddrRAM), .buttonCitaj(readRAM), .incBank(1'b0),
    .newRead(newReadRAM), .refresh(refreshRAM), .banka(banka), .Addr(Addr), .BA0(BA0), .BA1(BA1),
    .LDQM(LDQM), .UDQM(UDQM), .nWE(nWE), .nCAS(nCAS), .nRAS(nRAS), .nCS(nCS), .ramCLK(ramCLK),
    .ramCKE(ramCKE), .loadedData(loadedData), .trBIT(trBit), .IdleKorak(redKolona),
    .prviTaktKasnjenja(incPokKolona), .drugiTaktKasnjenja(ucitajKolonu), .ramDATA(ramDATA));
  and inst251 (inst251_out, xcetiri, yjedan);
  and inst276 (inst276_out, xcetiri, ydva);
  and inst280 (inst280_out, xcetiri, ytri);
  and inst284 (inst284_out, xcetiri, ycetiri);
  CMPX #(.size(10)) inst90 (.A(cetvrtiyDo), .B(ytr), .gr(inst90_gr));  // open: ls, eq
  or inst110 (clKolona4, inst251_out, inst276_out, inst280_out, undriven);
  CONSTX #(.size(10), .\const (405)) inst187 (.data(inst187_data));
  CMPX #(.size(10)) inst184 (.A(inst187_data), .B(ytr), .ls(manjeCetvrti), .eq(ycetiri), .gr(veceCetvrti));
  REGX #(.size(13), .default_value(0)) inst214 (
    .clk(CLK), .ld(ucitajRed4), .data_in(adresaReda), .data_out(inst214_data_out));  // open: cl, inc, dec
  MP13_4 inst235 (
    .I0({{5{1'b0}}, kolonica1}), .I1({{5{1'b0}}, kolonica2}), .I2({{5{1'b0}}, kolonica3}),
    .I3({{5{1'b0}}, kolonica4}), .signal0(Kkvadratic0), .signal1(Kkvadratic1), .out(inst235_out));
  or inst113 (inst113_out, incBank, clKolona1);
  REGX #(.size(8), .default_value(0)) inst221 (
    .clk(CLK), .cl(inst113_out), .inc(incKolona1), .data_out(kolonica1));  // open: ld, dec, data_in
  CMPX #(.size(10)) inst112 (.A(ytr), .B(prviyOd), .gr(inst112_gr));  // open: ls, eq
  CMPX #(.size(10)) inst129 (.A(ytr), .B(drugiyOd), .gr(inst129_gr));  // open: ls, eq
  CMPX #(.size(10)) inst134 (.A(ytr), .B(treciyOd), .gr(inst134_gr));  // open: ls, eq
  CMPX #(.size(10)) inst143 (.A(ytr), .B(cetvrtiyOd), .gr(inst143_gr));  // open: ls, eq
  CONSTX #(.size(10), .\const (208)) inst168 (.data(inst168_data));
  CMPX #(.size(10)) inst169 (.A(inst168_data), .B(xtr), .eq(xjedanN));  // open: ls, gr
  or inst116 (inst116_out, incBank, clKolona1);
  REGX #(.size(8), .default_value(0)) inst223 (
    .clk(CLK), .cl(inst116_out), .inc(incKolona2), .data_out(kolonica2));  // open: ld, dec, data_in
  CONSTX #(.size(10), .\const (305)) inst286 (.data(inst286_data));
  CMPX #(.size(10)) inst170 (.A(inst286_data), .B(xtr), .eq(xdvaN));  // open: ls, gr
  CMPX #(.size(10)) inst124 (.A(ytr), .B(prviyDo), .ls(inst124_ls));  // open: eq, gr
  CMPX #(.size(10)) inst130 (.A(ytr), .B(drugiyDo), .ls(inst130_ls));  // open: eq, gr
  CMPX #(.size(10)) inst139 (.A(ytr), .B(treciyDo), .ls(inst139_ls));  // open: eq, gr
  CMPX #(.size(10)) inst146 (.A(ytr), .B(cetvrtiyDo), .ls(inst146_ls));  // open: eq, gr
  or inst117 (inst117_out, incBank, clKolona1);
  and inst142 (treciDeo, inst139_ls, inst134_gr);
  REGX #(.size(8), .default_value(0)) inst233 (
    .clk(CLK), .cl(inst117_out), .inc(incKolona3), .data_out(kolonica3));  // open: ld, dec, data_in
  and inst128 (prviDeo, inst124_ls, inst112_gr);
  and inst131 (drugiDeo, inst130_ls, inst129_gr);
  and inst147 (cetvrtiDeo, inst146_ls, inst143_gr);
  CONSTX #(.size(10), .\const (402)) inst287 (.data(inst287_data));
  CMPX #(.size(10)) inst180 (.A(inst287_data), .B(xtr), .eq(xtriN));  // open: ls, gr
  CMPX #(.size(10)) inst94 (.A(prvixOd), .B(xtr), .eq(inst94_eq));  // open: ls, gr
  or inst272 (inst272_out, valid1, valid5, valid9, valid13);
  CMPX #(.size(10)) inst98 (.A(trecixOd), .B(xtr), .eq(inst98_eq));  // open: ls, gr
  or inst120 (inst120_out, incBank, clKolona1);
  or inst271 (inst271_out, valid3, valid7, valid11, valid15);
  REGX #(.size(8), .default_value(0)) inst234 (
    .clk(CLK), .cl(inst120_out), .inc(incKolona4), .data_out(kolonica4));  // open: ld, dec, data_in
  CONSTX #(.size(10), .\const (498)) inst288 (.data(inst288_data));
  or inst237 (inst237_out, inst94_eq, inst272_out);
  or inst241 (inst241_out, inst98_eq, inst271_out);
  CMPX #(.size(10)) inst285 (.A(inst288_data), .B(xtr), .eq(xcetiriN));  // open: ls, gr
  and inst236 (incKolona1, ucitajKolonu, inst237_out);
  and inst240 (incKolona3, ucitajKolonu, inst241_out);
  CMPX #(.size(10)) inst95 (.A(drugixOd), .B(xtr), .eq(inst95_eq));  // open: ls, gr
  CMPX #(.size(10)) inst99 (.A(cetvrtixOd), .B(xtr), .eq(inst99_eq));  // open: ls, gr
  or inst269 (inst269_out, valid2, valid6, valid10, valid14);
  or inst270 (inst270_out, valid4, valid8, valid12, valid16);
  or inst239 (inst239_out, inst95_eq, inst269_out);
  or inst243 (inst243_out, inst99_eq, inst270_out);
  and inst238 (incKolona2, ucitajKolonu, inst239_out);
  and inst242 (incKolona4, ucitajKolonu, inst243_out);
  or inst149 (inst149_out, ydva, drugiDeo);
  or inst166 (inst166_out, ytri, treciDeo);
  or inst167 (inst167_out, ycetiri, cetvrtiDeo);
  or inst148 (inst148_out, yjedan, prviDeo);
  and inst189 (inst189_out, xjedanN, inst148_out);
  and inst190 (inst190_out, xdvaN, inst148_out);
  and inst191 (inst191_out, xtriN, inst148_out);
  and inst192 (inst192_out, xcetiriN, inst148_out);
  and inst193 (inst193_out, xjedanN, inst149_out);
  and inst194 (inst194_out, xdvaN, inst149_out);
  and inst195 (inst195_out, xtriN, inst149_out);
  and inst196 (inst196_out, xcetiriN, inst149_out);
  and inst197 (inst197_out, xjedanN, inst166_out);
  and inst198 (inst198_out, xdvaN, inst166_out);
  and inst199 (inst199_out, xtriN, inst166_out);
  and inst200 (inst200_out, xcetiriN, inst166_out);
  and inst201 (inst201_out, xjedanN, inst167_out);
  and inst202 (inst202_out, xdvaN, inst167_out);
  and inst203 (inst203_out, xtriN, inst167_out);
  and inst204 (inst204_out, xcetiriN, inst167_out);
  PCD16NOVI inst188 (
    .I0(inst189_out), .I1(inst190_out), .I2(inst191_out), .I3(inst192_out), .I4(inst193_out),
    .I5(inst194_out), .I6(inst195_out), .I7(inst196_out), .I8(inst197_out), .I9(inst198_out),
    .I10(inst199_out), .I11(inst200_out), .I12(inst201_out), .I13(inst202_out), .I14(inst203_out),
    .I15(inst204_out), .E(1'b1), .D0(signalReg0), .D1(signalReg1), .D2(signalReg2), .D3(signalReg3),
    .W(ucitajTR));

  // Other names for the same wires on the sheet: trReg[15:0] = nesto

  // Notes on the sheet:
  //   Deo za SDRAm
  //   Unutrasnji kvadratici:
  //   Konstante:
  //   Adrese reda
  //   Adrese kolona
  //   ucitajTR
  //   ucitajKolonu
endmodule
